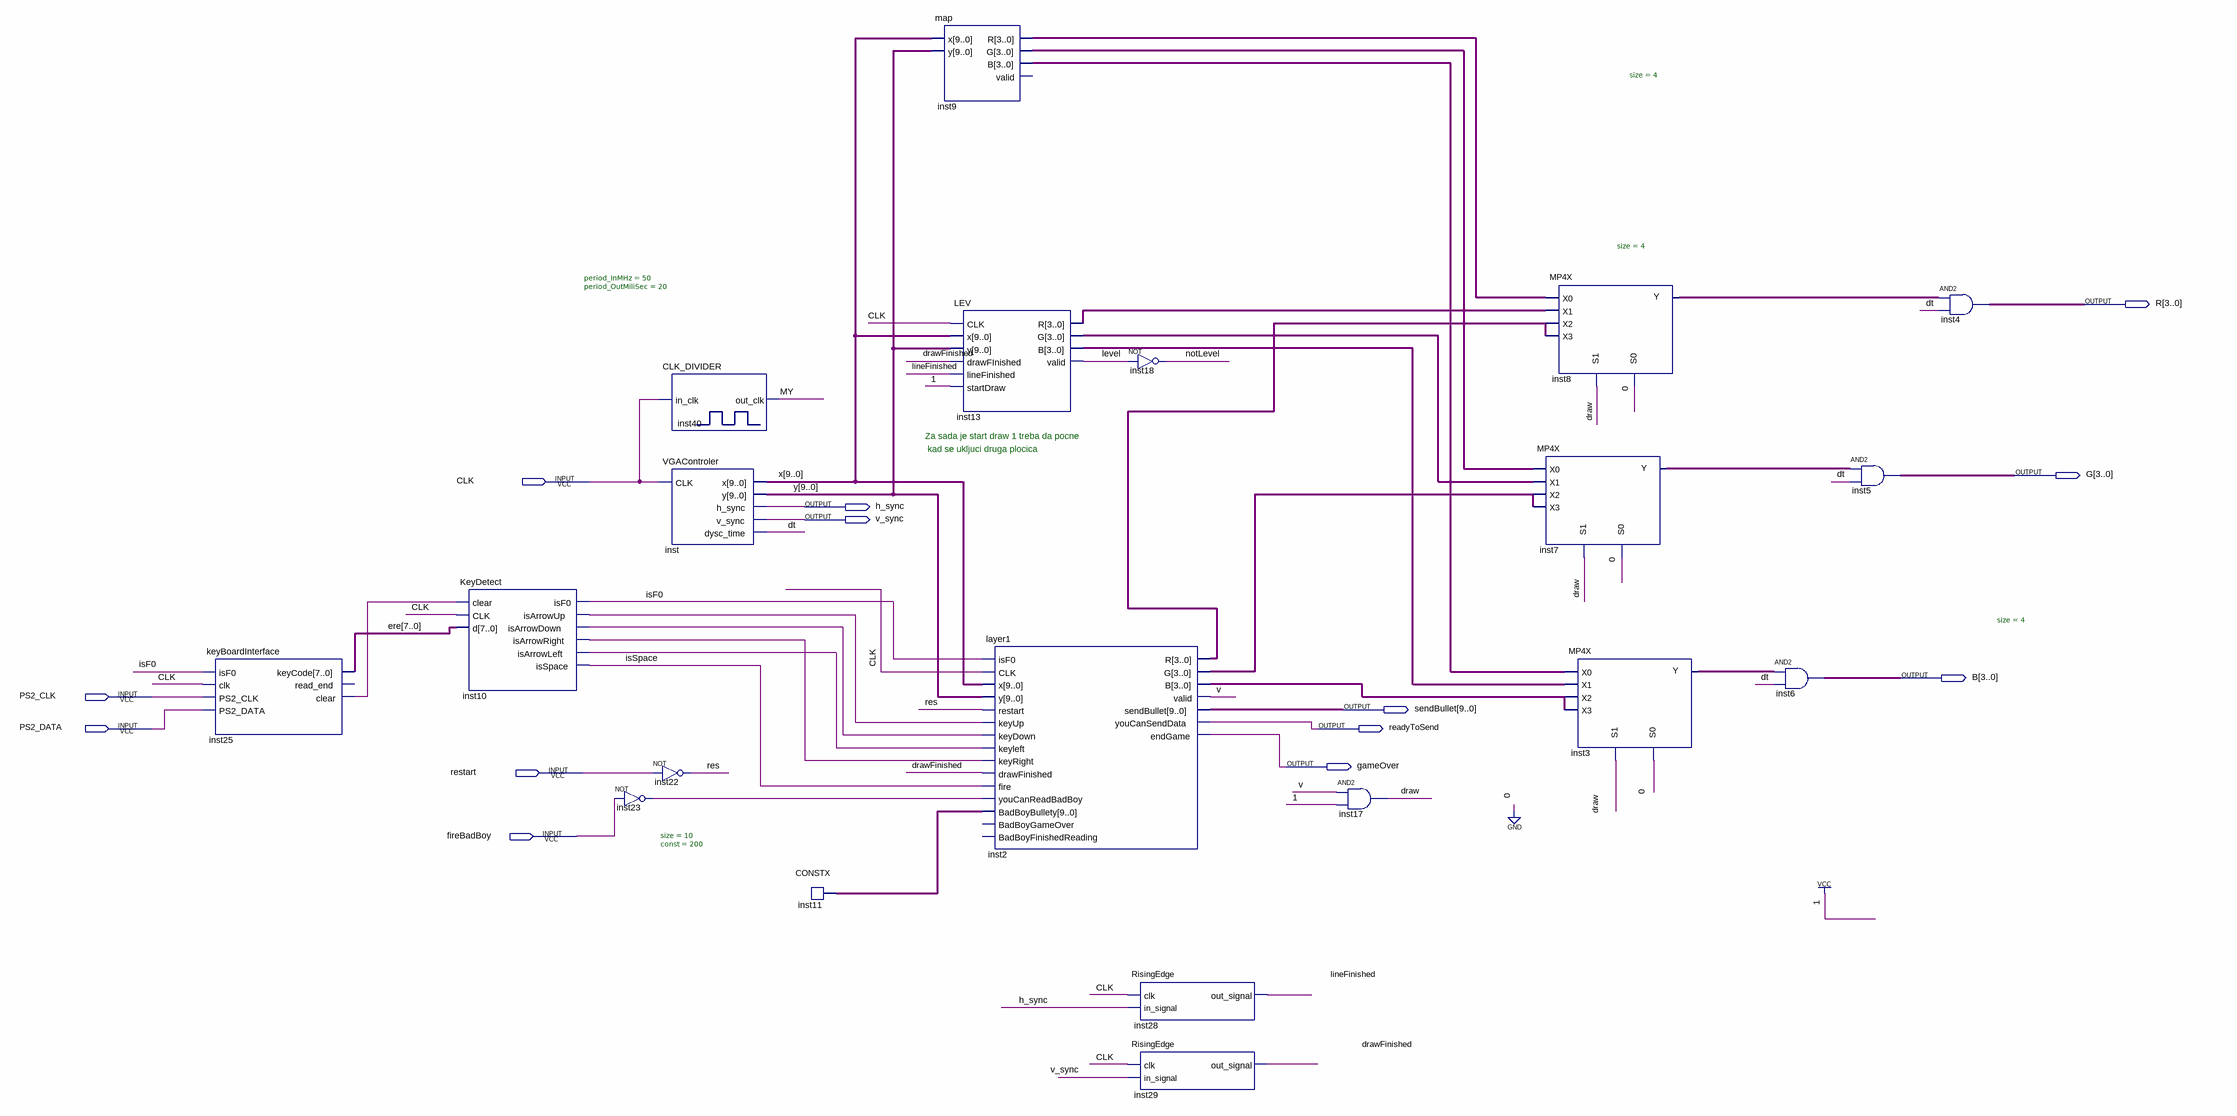
[diagram p0: schematic sheet]
// Quartus schematic goodBoy.bdf as structural Verilog: 20 symbols, 13 pins
module goodBoy (
  input  CLK,
  input  PS2_CLK,
  input  PS2_DATA,
  input  restart,
  input  fireBadBoy,
  output [3:0] R,
  output [3:0] G,
  output h_sync,
  output v_sync,
  output [3:0] B,
  output [9:0] sendBullet,
  output readyToSend,
  output gameOver
);

  wire draw, drawFinished, dt, inst10_isarrowdown, inst10_isarrowleft, inst10_isarrowright, inst10_isarrowup,
       inst23_out, inst25_clear, isF0, isSpace, level, lineFinished, MY, notLevel, res, v;
  wire [3:0] inst2_b, inst2_g, inst2_r, inst3_y, inst7_y, inst8_y, inst9_b, inst9_g, inst9_r, inst13_b,
       inst13_g, inst13_r;
  wire [7:0] ere;
  wire [9:0] inst11_data, x, y;

  keyBoardInterface inst25 (
    .isF0(isF0), .clk(CLK), .PS2_CLK(PS2_CLK), .PS2_DATA(PS2_DATA), .keyCode(ere), .clear(inst25_clear));  // open: read_end
  KeyDetect inst10 (
    .clear(inst25_clear), .CLK(CLK), .d(ere), .isF0(isF0), .isArrowUp(inst10_isarrowup),
    .isArrowDown(inst10_isarrowdown), .isArrowRight(inst10_isarrowright), .isArrowLeft(inst10_isarrowleft),
    .isSpace(isSpace));
  not inst23 (inst23_out, fireBadBoy);
  CLK_DIVIDER #(.period_InMHz(50), .period_OutMiliSec(20)) inst40 (.in_clk(CLK), .out_clk(MY));
  VGAControler inst (.CLK(CLK), .x(x), .y(y), .h_sync(h_sync), .v_sync(v_sync), .dysc_time(dt));
  not inst22 (res, restart);
  CONSTX #(.size(10), .\const (200)) inst11 (.data(inst11_data));
  map inst9 (.x(x), .y(y), .R(inst9_r), .G(inst9_g), .B(inst9_b));  // open: valid
  LEV inst13 (
    .CLK(CLK), .x(x), .y(y), .drawFInished(drawFinished), .lineFinished(lineFinished), .startDraw(1'b1),
    .R(inst13_r), .G(inst13_g), .B(inst13_b), .valid(level));
  layer1 inst2 (
    .isF0(isF0), .CLK(CLK), .x(x), .y(y), .restart(res), .keyUp(inst10_isarrowup),
    .keyDown(inst10_isarrowdown), .keyleft(inst10_isarrowleft), .keyRight(inst10_isarrowright),
    .drawFinished(drawFinished), .fire(isSpace), .youCanReadBadBoy(inst23_out), .BadBoyBullety(inst11_data),
    .R(inst2_r), .G(inst2_g), .B(inst2_b), .valid(v), .sendBullet(sendBullet), .youCanSendData(readyToSend),
    .endGame(gameOver));  // open: BadBoyGameOver, BadBoyFinishedReading
  not inst18 (notLevel, level);
  RisingEdge inst28 (.clk(CLK), .in_signal(h_sync), .out_signal(lineFinished));
  RisingEdge inst29 (.clk(CLK), .in_signal(v_sync), .out_signal(drawFinished));
  and inst17 (draw, v, 1'b1);
  MP4X #(.size(4)) inst7 (.X0(inst9_g), .X1(inst13_g), .X2(inst2_g), .X3(inst2_g), .S1(draw), .S0(1'b0), .Y(inst7_y));
  MP4X #(.size(4)) inst8 (.X0(inst9_r), .X1(inst13_r), .X2(inst2_r), .X3(inst2_r), .S1(draw), .S0(1'b0), .Y(inst8_y));
  MP4X #(.size(4)) inst3 (.X0(inst9_b), .X1(inst13_b), .X2(inst2_b), .X3(inst2_b), .S1(draw), .S0(1'b0), .Y(inst3_y));
  assign B = inst3_y & {4{dt}};  // AND2 inst6, 4 bits wide
  assign G = inst7_y & {4{dt}};  // AND2 inst5, 4 bits wide
  assign R = inst8_y & {4{dt}};  // AND2 inst4, 4 bits wide

  // Notes on the sheet:
  //   Za sada je start draw 1 treba da pocne
  //    kad se ukljuci druga plocica
endmodule
